# EAGLE schematic Templates_CAN_bus (EAGLE 9.6.1)
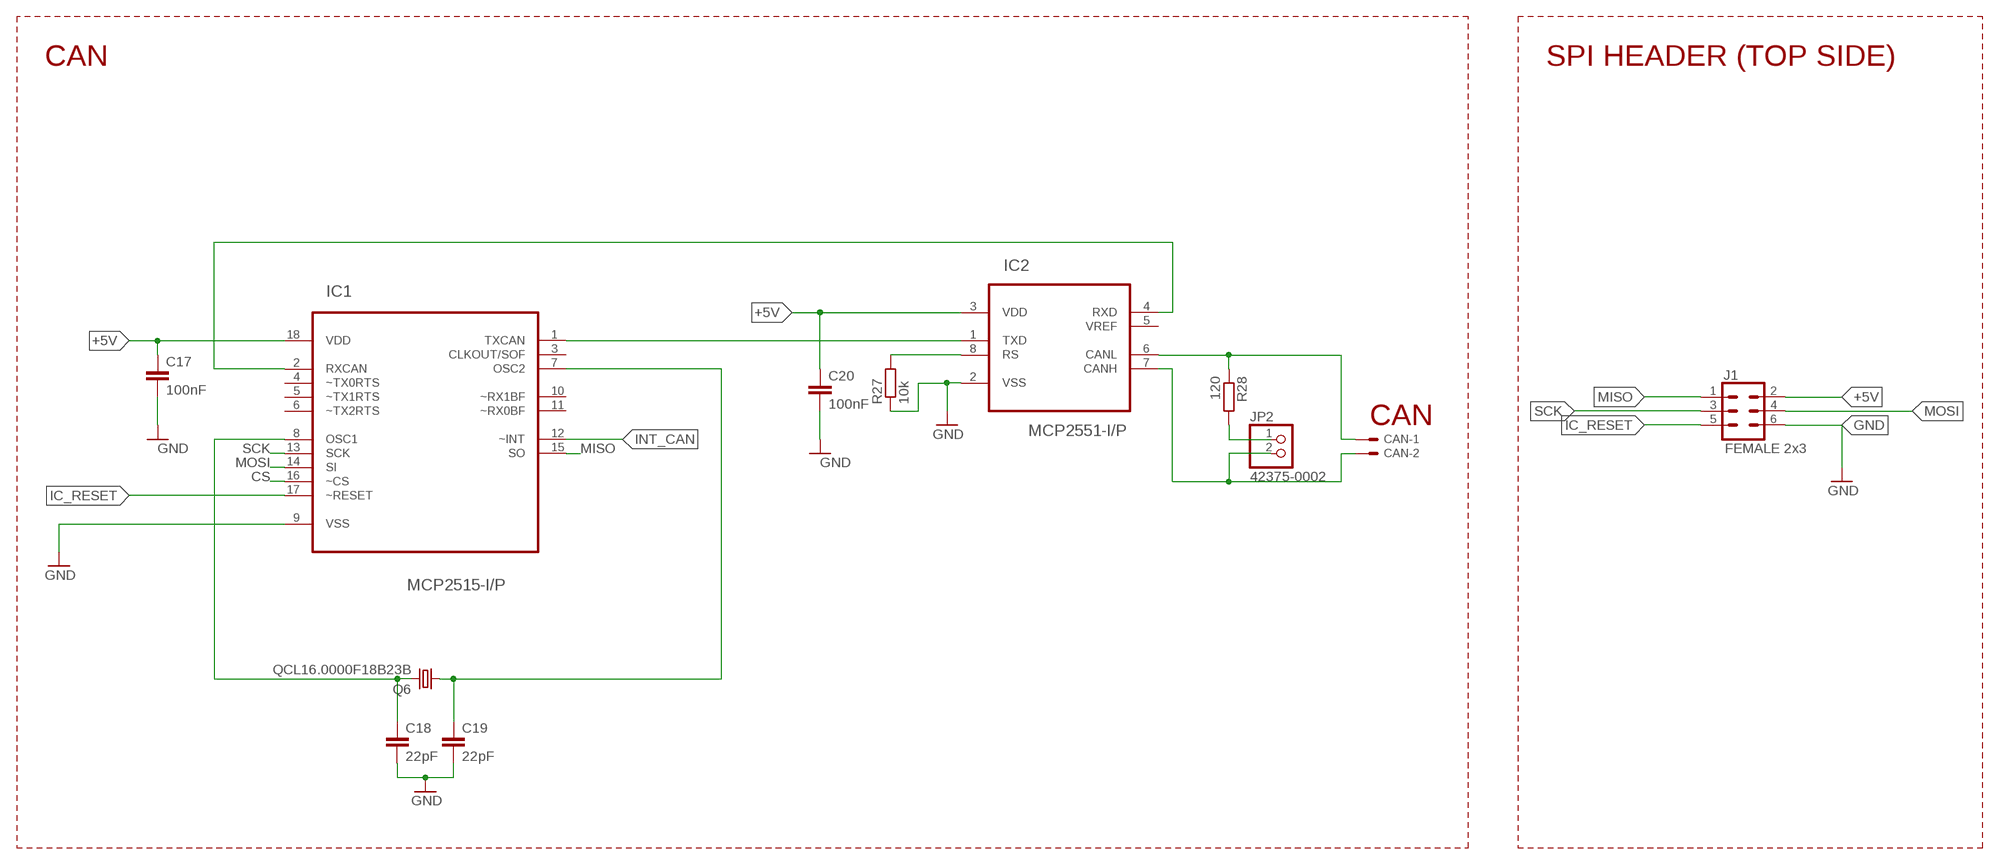
[diagram p0: schematic, sheet 1]

## Parts
C17  100nF  C-EU025-025X050  [C025-025X050]
C18  22pF  C-EU050-024X044  [C050-024X044]
C19  22pF  C-EU050-024X044  [C050-024X044]
C20  100nF  C-EU025-025X050  [C025-025X050]
CAN  JST-XH-RIGHTANGLE-2-PIN-LONG-PAD  [JST-XH-RIGHTANGLE-2-PACKAGE-LONG-PAD]
IC1  MCP2515-I/P  [DIP254P762X432-18]
IC2  MCP2551-I/P  [DIP254P762X432-8]
J1  FEMALE 2x3  CONN_03X2FEMALE  [2X3]
JP2  42375-0002  PINHD-1X2  [1X02]
Q6  QCL16.0000F18B23B  CRYSTALHC49S  [HC49/S]
R27  10k  R-EU_0207/7  [0207/7]
R28  120  R-EU_0207/7  [0207/7]

## Nets
+5V: C17.1 C20.1 IC1.18(VDD) IC2.3(VDD) J1.2
CS: IC1.16(~CS)
GND: C17.2 C18.2 C19.2 C20.2 IC1.9(VSS) IC2.2(VSS) J1.6 R27.1
IC_RESET: IC1.17(~RESET) J1.5
INT_CAN: IC1.12(~INT)
MISO: IC1.15(SO) J1.1
MOSI: IC1.14(SI) J1.4
N$11: C19.1 IC1.7(OSC2) Q6.1
N$23: CAN.1 IC2.6(CANL) R28.1
N$32: IC1.1(TXCAN) IC2.1(TXD)
N$33: IC1.2(RXCAN) IC2.4(RXD)
N$34: C18.1 IC1.8(OSC1) Q6.2
N$37: IC2.8(RS) R27.2
N$39: JP2.1 R28.2
N$40: CAN.2 IC2.7(CANH) JP2.2
SCK: IC1.13(SCK) J1.3
Unconnected: IC1.3(CLKOUT/SOF) IC1.4(~TX0RTS) IC1.5(~TX1RTS) IC1.6(~TX2RTS) IC1.10(~RX1BF) IC1.11(~RX0BF) IC2.5(VREF)

## Notes on the sheet
- CAN | SPI HEADER (TOP SIDE)
- CAN

## Library data of the parts
C17 C20 = resistor:C-EU: CAPACITOR, European symbol
C18 C19 = rcl:C-EU: CAPACITOR, European symbol; SPICEPREFIX: C
CAN = ASeligmann:JST-XH-RIGHTANGLE-2-PIN
IC1 = MCP2515-I_P:MCP2515-I/P: Stand-Alone CAN Controller; AVAILABILITY: Unavailable; DESCRIPTION: MCP2515 Series 5.5 V 1 Mb/s Stand Alone SPI Interface CAN Controller - PDIP-18; MF: Microchip; MP: MCP2515-I/P; PACKAGE: DIP-18 Microchip; PRICE: None
IC2 = MCP2551-I_P:MCP2551-I/P: High-Speed CAN Transceiver; AVAILABILITY: Unavailable; DESCRIPTION: MCP2551 Series 5.5 V 1 Mb/s Surface Mount High-Speed CAN Transceiver - PDIP-8; MF: Microchip; MP: MCP2551-I/P; PACKAGE: DIP-8 Microchip; PRICE: None
J1 = SparkFun-Connectors:CONN_03X2: Multi connection point. Often used as Generic Header-pin footprint for 0.1 inch spaced/style header connections You can populate with any combo of single row headers, but if you'd like an exact match, check these: Header - 2x3 (Male, 0.1") <https://www.sparkfun.com/products/12807> (PRT-12807) Header - 2x3 (Female, 0.1") <https://www.sparkfun.com/products/13010> (PRT-13010) 2x3 Pin Shrouded Header <https://www.sparkfun.com/products/10877> (PRT-10877) On any of the 0.1 inch spaced packages, you can populate with these: Break Away Headers - Straight <https://www.sparkfun.com/products/116> (PRT-00116) Break Away Male Headers - Right Angle <https://www.sparkfun.com/products/553> (PRT-00553) Female Headers <https://www.sparkfun.com/products/115> (PRT-00115) Break Away Headers - Machine Pin <https://www.sparkfun.com/products/117> (PRT-00117) Break Away Female Headers - Swiss Machine Pin <https://www.sparkfun.com/products/743> (PRT-00743) Special note: the shrouded connector mates well with our 3x2 ribbon cables: Ribbon Crimp Connector - 6-pin (2x3, Female) <https://www.sparkfun.com/products/10651> (PRT-10651) Ribbon Cable - 6 wire (15ft) <https://www.sparkfun.com/products/10646> (PRT-10646); PROD_ID: CONN-11566
JP2 = pinhead:PINHD-1X2: PIN HEADER
Q6 = adafruit:CRYSTAL: CRYSTAL; OC_FARNELL: 1667008; OC_NEWARK: unknown
R27 R28 = resistor:R-EU_: RESISTOR, European symbol